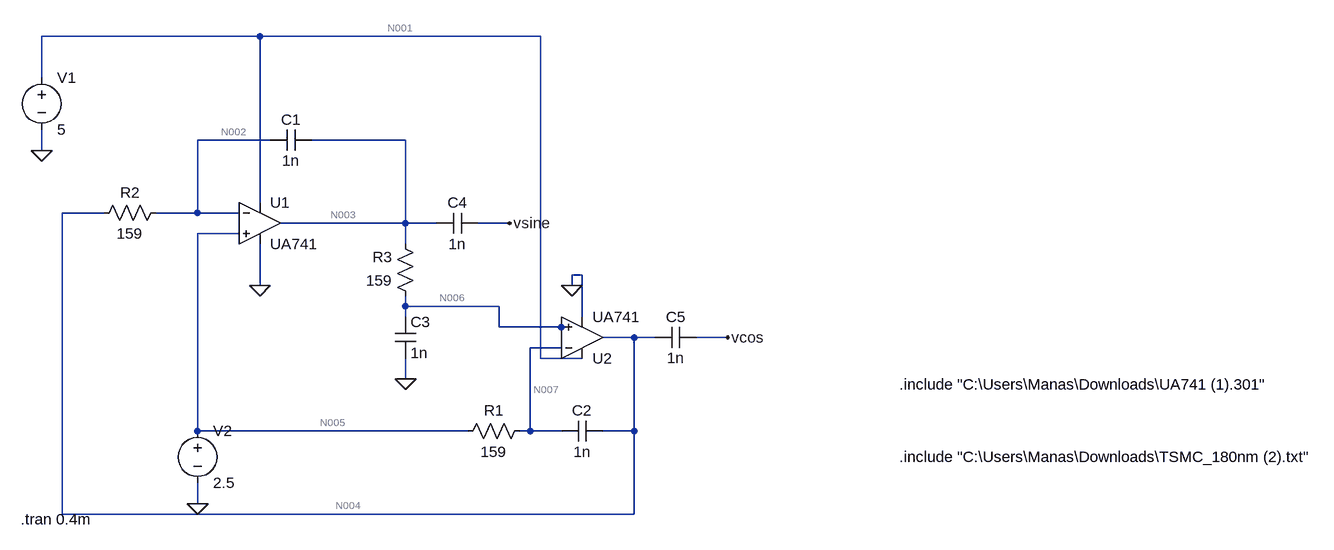
[diagram p0: schematic quad osc 2.asc]
quad osc 2.asc, the LTspice schematic file:
Version 4
SHEET 1 1900 680
WIRE 192 -128 -144 -128
WIRE 624 -128 192 -128
WIRE -144 -64 -144 -128
WIRE 208 32 96 32
WIRE 416 32 272 32
WIRE -144 48 -144 16
WIRE 192 128 192 -128
WIRE -48 144 -112 144
WIRE 96 144 96 32
WIRE 96 144 32 144
WIRE 160 144 96 144
WIRE 416 160 416 32
WIRE 416 160 224 160
WIRE 464 160 416 160
WIRE 576 160 528 160
WIRE 160 176 96 176
WIRE 416 192 416 160
WIRE 688 240 672 240
WIRE 192 256 192 192
WIRE 672 256 672 240
WIRE 416 288 416 272
WIRE 560 288 416 288
WIRE 416 304 416 288
WIRE 688 304 688 240
WIRE 560 320 560 288
WIRE 656 320 560 320
WIRE 672 320 656 320
WIRE 768 336 720 336
WIRE 800 336 768 336
WIRE 912 336 864 336
WIRE 656 352 608 352
WIRE 624 368 624 -128
WIRE 688 368 624 368
WIRE 416 400 416 368
WIRE 96 480 96 176
WIRE 512 480 96 480
WIRE 608 480 608 352
WIRE 608 480 592 480
WIRE 656 480 608 480
WIRE 768 480 768 336
WIRE 768 480 720 480
WIRE 96 592 96 560
WIRE -112 608 -112 144
WIRE 768 608 768 480
WIRE 768 608 -112 608
FLAG 416 400 0
FLAG 192 256 0
FLAG -144 48 0
FLAG 672 256 0
FLAG 96 592 0
FLAG 576 160 vsine
FLAG 912 336 vcos
SYMBOL OpAmps\\opamp2 192 96 R0
SYMATTR InstName U1
SYMATTR Value UA741
SYMBOL OpAmps\\opamp2 688 400 M180
SYMATTR InstName U2
SYMATTR Value UA741
SYMBOL cap 272 16 R90
WINDOW 0 0 32 VBottom 2
WINDOW 3 32 32 VTop 2
SYMATTR InstName C1
SYMATTR Value 1n
SYMBOL cap 720 464 R90
WINDOW 0 0 32 VBottom 2
WINDOW 3 32 32 VTop 2
SYMATTR InstName C2
SYMATTR Value 1n
SYMBOL res 608 464 R90
WINDOW 0 0 56 VBottom 2
WINDOW 3 32 56 VTop 2
SYMATTR InstName R1
SYMATTR Value 159
SYMBOL res 48 128 R90
WINDOW 0 0 56 VBottom 2
WINDOW 3 32 56 VTop 2
SYMATTR InstName R2
SYMATTR Value 159
SYMBOL res 432 288 R180
WINDOW 0 36 76 Left 2
WINDOW 3 36 40 Left 2
SYMATTR InstName R3
SYMATTR Value 159
SYMBOL cap 400 304 R0
SYMATTR InstName C3
SYMATTR Value 1n
SYMBOL voltage -144 -80 R0
WINDOW 123 0 0 Left 0
WINDOW 39 0 0 Left 0
SYMATTR InstName V1
SYMATTR Value 5
SYMBOL voltage 96 464 R0
WINDOW 123 0 0 Left 0
WINDOW 39 0 0 Left 0
SYMATTR InstName V2
SYMATTR Value 2.5
SYMBOL cap 528 144 R90
WINDOW 0 0 32 VBottom 2
WINDOW 3 32 32 VTop 2
SYMATTR InstName C4
SYMATTR Value 1n
SYMBOL cap 864 320 R90
WINDOW 0 0 32 VBottom 2
WINDOW 3 32 32 VTop 2
SYMATTR InstName C5
SYMATTR Value 1n
TEXT -176 616 Left 2 !.tran 0.4m
TEXT 1176 520 Left 2 !.include "C:\\Users\\Manas\\Downloads\\TSMC_180nm (2).txt"
TEXT 1176 408 Left 2 !.include "C:\\Users\\Manas\\Downloads\\UA741 (1).301"

The netlist it stands for:
* quad osc 2.asc
XU1 N005 N002 N001 0 N003 UA741  ; pins In+ In- V+ V- OUT
XU2 N006 N007 N001 0 N004 UA741  ; pins In+ In- V+ V- OUT
C1 N003 N002 1n
C2 N004 N007 1n
R1 N007 N005 159
R2 N002 N004 159
R3 N006 N003 159
C3 N006 0 1n
V1 N001 0 5
V2 N005 0 2.5
C4 vsine N003 1n
C5 vcos N004 1n
.tran 0.4m
.include "C:\Users\Manas\Downloads\TSMC_180nm (2).txt"
.include "C:\Users\Manas\Downloads\UA741 (1).301"
.backanno
.end

* Results of the author's LTspice run, read from the files saved beside the schematic
* Operating Point, zero values left out:
*   V(n003) = 2.5 V
*   V(n001) = 5 V
*   V(n002) = 2.5 V
*   V(n005) = 2.5 V
*   V(n004) = 2.5 V
*   V(n007) = 2.5 V
*   V(n006) = 2.5 V
*   I(R1) = -79.77 nA
*   I(R2) = -79.77 nA
*   I(R3) = -79.75 nA
*   I(V1) = -572.1 µA
*   I(V2) = -159.5 nA
*   Ix(u1:1) = 79.75 nA
*   Ix(u1:2) = 79.77 nA
*   Ix(u1:3) = 286.1 µA
*   Ix(u1:4) = -286.3 µA
*   Ix(u1:5) = -79.75 nA
*   Ix(u2:1) = 79.75 nA
*   Ix(u2:2) = 79.77 nA
*   Ix(u2:3) = 286.1 µA
*   Ix(u2:4) = -286.3 µA
*   Ix(u2:5) = -79.77 nA
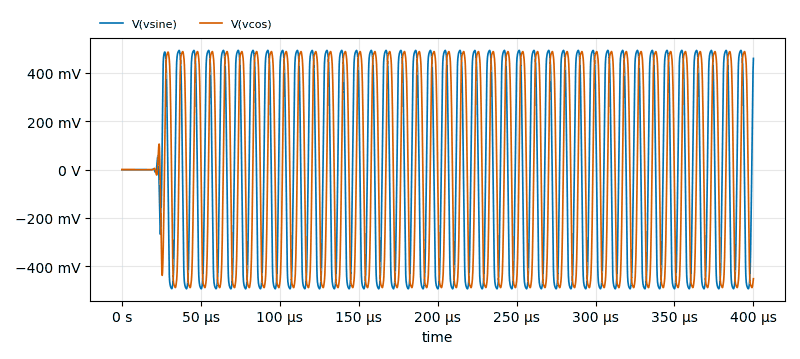
[diagram p1: Transient Analysis of quad osc 2.asc, plotted from the saved traces]
* Transient Analysis, 1 run:
*   V(vsine): min -493.5 mV, max 493.5 mV, average -1.397 mV, rms 390.8 mV, last 460.2 mV
*   V(vcos): min -488.6 mV, max 488.6 mV, average -1.069 mV, rms 384.1 mV, last -451.5 mV